# EAGLE design headstage_isolation_board_01 (EAGLE 7.5.0)
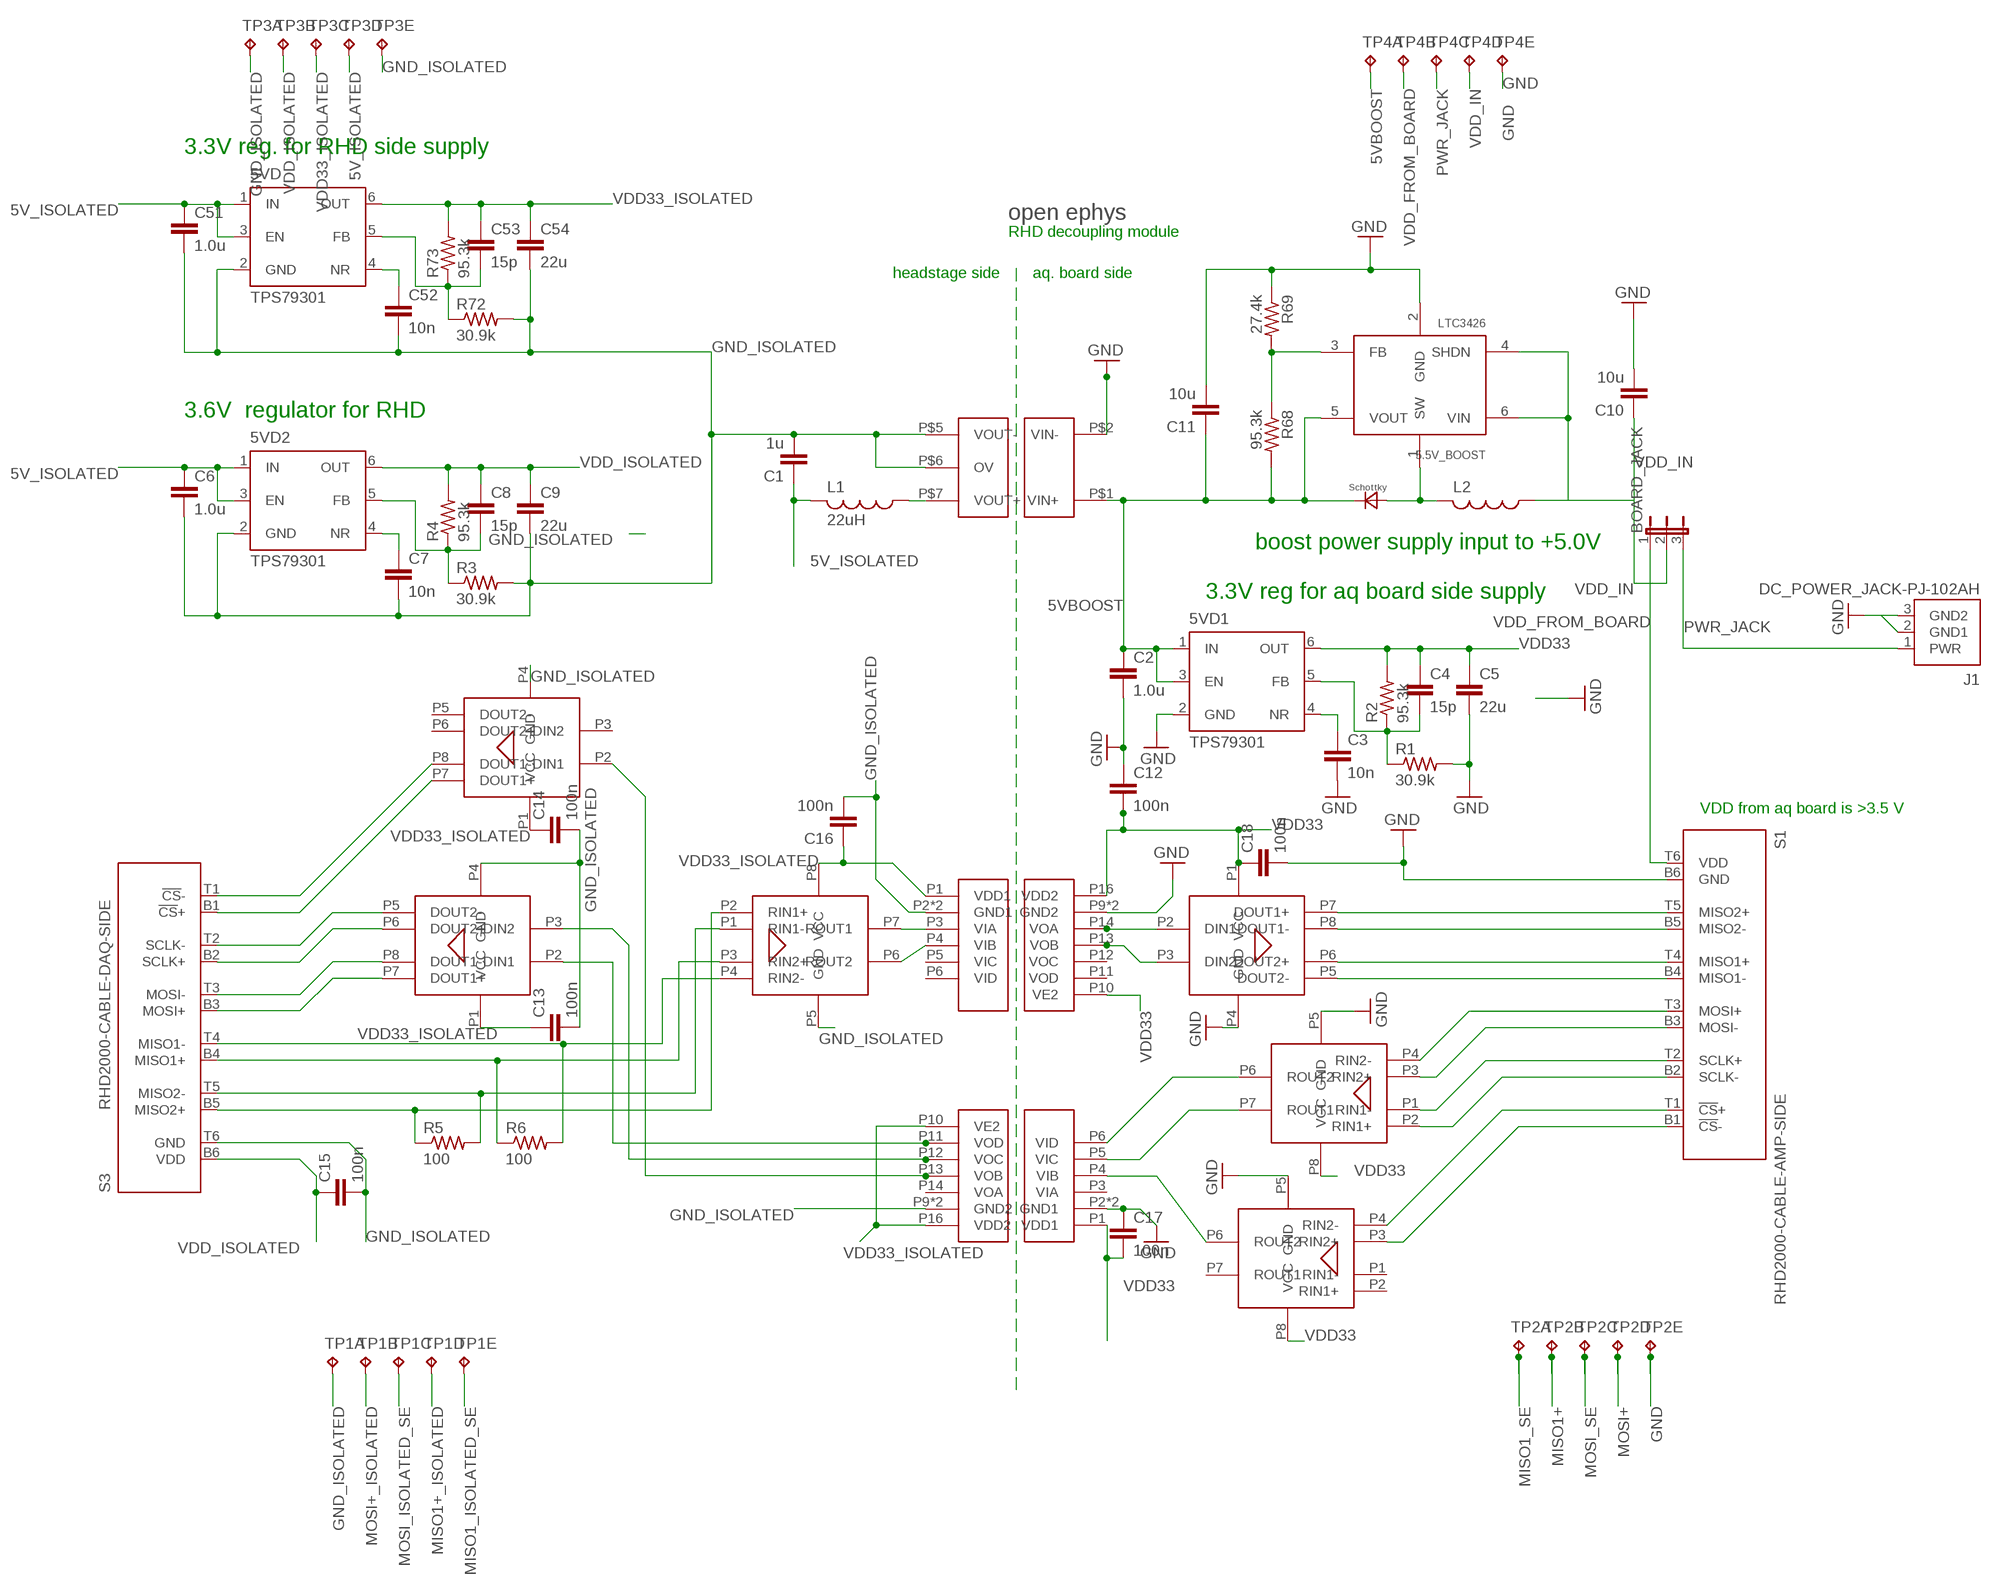
[diagram p0: schematic, sheet 1]

## Parts
5.5V_BOOST  LTC3426  [SOT23-6]
5VD  TPS79301  [SOT-23-6]
5VD1  TPS79301  [SOT-23-6]
5VD2  TPS79301  [SOT-23-6]
BOARD_JACK  JP2E  [JP2]
C1  1u  C_1206  [1206]
C2  1.0u  C_0805  [0805]
C3  10n  C_0603  [0603]
C4  15p  C_0603  [0603]
C5  22u  C_1206  [1206]
C6  1.0u  C_0805  [0805]
C7  10n  C_0603  [0603]
C8  15p  C_0603  [0603]
C9  22u  C_1206  [1206]
C10  10u  C_1206  [1206]
C11  10u  C_1206  [1206]
C12  100n  C_0603  [0603]
C13  100n  C_0603  [0603]
C14  100n  C_0603  [0603]
C15  100n  C_0603  [0603]
C16  100n  C_0603  [0603]
C17  100n  C_0603  [0603]
C18  100n  C_0603  [0603]
C51  1.0u  C_0805  [0805]
C52  10n  C_0603  [0603]
C53  15p  C_0603  [0603]
C54  22u  C_1206  [1206]
D1  MBRA210LT3-D  [MBRA210LT3-D]
J1  DC_POWER_JACK-PJ-102AH  [PJ-102AH]
L1  22uH  L_1206  [1206]
L2  L_1206  [1206]
R1  30.9k  R_0603  [0603]
R2  95.3k  R_0603  [0603]
R3  30.9k  R_0603  [0603]
R4  95.3k  R_0603  [0603]
R5  100  R_0603  [0603]
R6  100  R_0603  [0603]
R68  95.3k  R_0603  [0603]
R69  27.4k  R_0603  [0603]
R72  30.9k  R_0603  [0603]
R73  95.3k  R_0603  [0603]
S1  RHD2000-CABLE-AMP-SIDE  [OMNETICS_PZN-12-AA]
S3  RHD2000-CABLE-DAQ-SIDE  [OMNETICS_PZN-12-AA]
TP1  TP5P5-25-13  [P5-25-13]
TP2  TP5P5-25-13  [P5-25-13]
TP3  TP5P5-25-13  [P5-25-13]
TP4  TP5P5-25-13  [P5-25-13]
U$1  OPEN_EPHYS_LOGO  [OPEN_EPHYS_LOGO]
U$2  ADUM3440  [SOIC_WIDE_16]
U$4  ADN4663  [8-SOIC]
U$5  ADN4663  [8-SOIC]
U$6  ADN4664  [8-SOIC]
U$7  ADN4664  [8-SOIC]
U$8  ADN4664  [8-SOIC]
U$9  ADN4663  [8-SOIC]
U$10  ADUM3440  [SOIC_WIDE_16]
U$12  NMV0505  [NMV0505]

## Nets
5V_ISOLATED: 5VD2.1(IN) 5VD2.3(EN) 5VD.1(IN) 5VD.3(EN) C1.1 C6.1 C51.1 L1.2 TP3.TP-4
5VBOOST: 5.5V_BOOST.5(VOUT) 5VD1.1(IN) 5VD1.3(EN) C2.1 C11.1 D1.NEG R68.2 TP4.TP-1 U$12.P$1(VIN+)
CS+: S1.T1(!CS!+) U$8.P4(RIN2-)
CS+_ISOLATED: S3.B1(!CS!+) U$9.P7(DOUT1+)
CS-: S1.B1(!CS!-) U$8.P3(RIN2+)
CS-_ISOLATED: S3.T1(!CS!-) U$9.P8(DOUT1-)
CS_ISOLATED_SE: U$2.P13(VOB) U$9.P2(DIN1)
CS_SE: U$2.P4(VIB) U$8.P6(ROUT2)
GND: 5.5V_BOOST.2(GND) 5VD1.2(GND) C2.2 C3.2 C5.2 C10.2 C11.2 C12.1 C17.1 C18.2 J1.2(GND1) J1.3(GND2) R1.2 R69.1 S1.B6(GND) TP2.TP-5 TP4.TP-5 U$2.P2(GND1) U$2.P8(GND1) U$4.P4(GND) U$7.P5(GND) U$8.P5(GND) U$10.P9(GND2) U$10.P15(GND2) U$12.P$2(VIN-)
GND4: C15.2
GND_ISOLATED: 5VD2.2(GND) 5VD.2(GND) C1.2 C6.2 C7.2 C9.2 C13.2 C14.2 C16.2 C51.2 C52.2 C54.2 R3.2 R72.2 S3.T6(GND) TP1.TP-1 TP3.TP-1 TP3.TP-5 U$2.P9(GND2) U$2.P15(GND2) U$5.P4(GND) U$6.P5(GND) U$9.P4(GND) U$10.P2(GND1) U$10.P8(GND1) U$12.P$5(VOUT-) U$12.P$6(OV)
MISO1+: S1.T4(MISO1+) TP2.TP-2 U$4.P6(DOUT2+)
MISO1+_ISOLATED: R6.1 S3.B4(MISO1+) TP1.TP-4 U$6.P3(RIN2+)
MISO1-: S1.B4(MISO1-) U$4.P5(DOUT2-)
MISO1-_ISOLATED: R6.2 S3.T4(MISO1-) U$6.P4(RIN2-)
MISO1_ISOLATED_SE: TP1.TP-5 U$6.P6(ROUT2) U$10.P4(VIB)
MISO1_SE: TP2.TP-1 U$4.P3(DIN2) U$10.P13(VOB)
MISO2+: S1.T5(MISO2+) U$4.P7(DOUT1+)
MISO2+_ISOLATED: R5.1 S3.B5(MISO2+) U$6.P2(RIN1+)
MISO2-: S1.B5(MISO2-) U$4.P8(DOUT1-)
MISO2-_ISOLATED: R5.2 S3.T5(MISO2-) U$6.P1(RIN1-)
MISO2_ISOLATED_SE: U$6.P7(ROUT1) U$10.P3(VIA)
MISO2_SE: U$4.P2(DIN1) U$10.P14(VOA)
MOSI+: S1.T3(MOSI+) TP2.TP-4 U$7.P4(RIN2-)
MOSI+_ISOLATED: S3.B3(MOSI+) TP1.TP-2 U$5.P7(DOUT1+)
MOSI-: S1.B3(MOSI-) U$7.P3(RIN2+)
MOSI-_ISOLATED: S3.T3(MOSI-) U$5.P8(DOUT1-)
MOSI_ISOLATED_SE: TP1.TP-3 U$2.P11(VOD) U$5.P2(DIN1)
MOSI_SE: TP2.TP-3 U$2.P6(VID) U$7.P6(ROUT2)
N$32: L1.1 U$12.P$7(VOUT+)
N$33: 5VD1.4(NR) C3.1
N$35: 5VD1.5(FB) C4.2 R1.1 R2.1
N$36: 5VD2.4(NR) C7.1
N$37: 5VD2.5(FB) C8.2 R3.1 R4.1
N$97: 5VD.4(NR) C52.1
N$108: 5VD.5(FB) C53.2 R72.1 R73.1
N$276: 5.5V_BOOST.3(FB) R68.1 R69.2
N$278: 5.5V_BOOST.1(SW) D1.POS L2.2
PWR_JACK: BOARD_JACK.3 J1.1(PWR) TP4.TP-3
SCLK+: S1.T2(SCLK+) U$7.P1(RIN1-)
SCLK+_ISOLATED: S3.B2(SCLK+) U$5.P6(DOUT2+)
SCLK-: S1.B2(SCLK-) U$7.P2(RIN1+)
SCLK-_ISOLATED: S3.T2(SCLK-) U$5.P5(DOUT2-)
SCLK_ISOLATED_SE: U$2.P12(VOC) U$5.P3(DIN2)
SCLK_SE: U$2.P5(VIC) U$7.P7(ROUT1)
VDD33: 5VD1.6(OUT) C4.1 C5.1 C12.2 C17.2 C18.1 R2.2 U$2.P1(VDD1) U$4.P1(VCC) U$7.P8(VCC) U$8.P8(VCC) U$10.P10(VE2) U$10.P16(VDD2)
VDD33_ISOLATED: 5VD.6(OUT) C13.1 C14.1 C16.1 C53.1 C54.1 R73.2 TP3.TP-3 U$2.P10(VE2) U$2.P16(VDD2) U$5.P1(VCC) U$6.P8(VCC) U$9.P1(VCC) U$10.P1(VDD1)
VDD_FROM_BOARD: BOARD_JACK.1 S1.T6(VDD) TP4.TP-2
VDD_IN: 5.5V_BOOST.4(SHDN) 5.5V_BOOST.6(VIN) BOARD_JACK.2 C10.1 L2.1 TP4.TP-4
VDD_ISOLATED: 5VD2.6(OUT) C8.1 C9.1 C15.1 R4.2 S3.B6(VDD) TP3.TP-2
Unconnected: U$2.P3(VIA) U$2.P14(VOA) U$8.P1(RIN1-) U$8.P2(RIN1+) U$8.P7(ROUT1) U$9.P3(DIN2) U$9.P5(DOUT2-) U$9.P6(DOUT2+) U$10.P5(VIC) U$10.P6(VID) U$10.P11(VOD) U$10.P12(VOC)

## Notes on the sheet
- 3.3V reg. for RHD side supply
- RHD decoupling module
- headstage side | aq. board side
- 3.6V  regulator for RHD
- boost power supply input to +5.0V
- 3.3V reg for aq board side supply
- VDD from aq board is >3.5 V

## Library data of the parts
5.5V_BOOST = open-ephys:LTC3426: Boost converter
5VD 5VD1 5VD2 = RHD2000_eval_board:TPS79301: Texas Instruments TPS79301 adjustable regulator
BOARD_JACK = jumper:JP2E: JUMPER
C1-C18 C51-C54 = RHD2000_eval_board:C: Capacitor
D1 = open-ephys:MBRA210LT3-D: Schottky diode
J1 = RHD2000_eval_board:DC_POWER_JACK: DC Power Jack
L1 L2 = RHD2000_eval_board:L: Inductor
R1-R6 R68 R69 R72 R73 = RHD2000_eval_board:R: Resistor
S1 = RHD2000:RHD2000-CABLE-AMP-SIDE
S3 = RHD2000_eval_board:RHD2000-CABLE-DAQ-SIDE: Omnetics PZN-12-AA RHD2000 socket - DAQ side
TP1-TP4 = testpad:TP5: Test pad
U$1 = open-ephys:OPEN_EPHYS_LOGO: Open Ephys logo
U$2 U$10 = open-ephys_old:ADUM3440
U$4 U$5 U$9 = open-ephys:ADN4663
U$6-U$8 = open-ephys:ADN4664
U$12 = open-ephys:NMV0505

## Net classes
1 power: width 0.381 mm

## Board
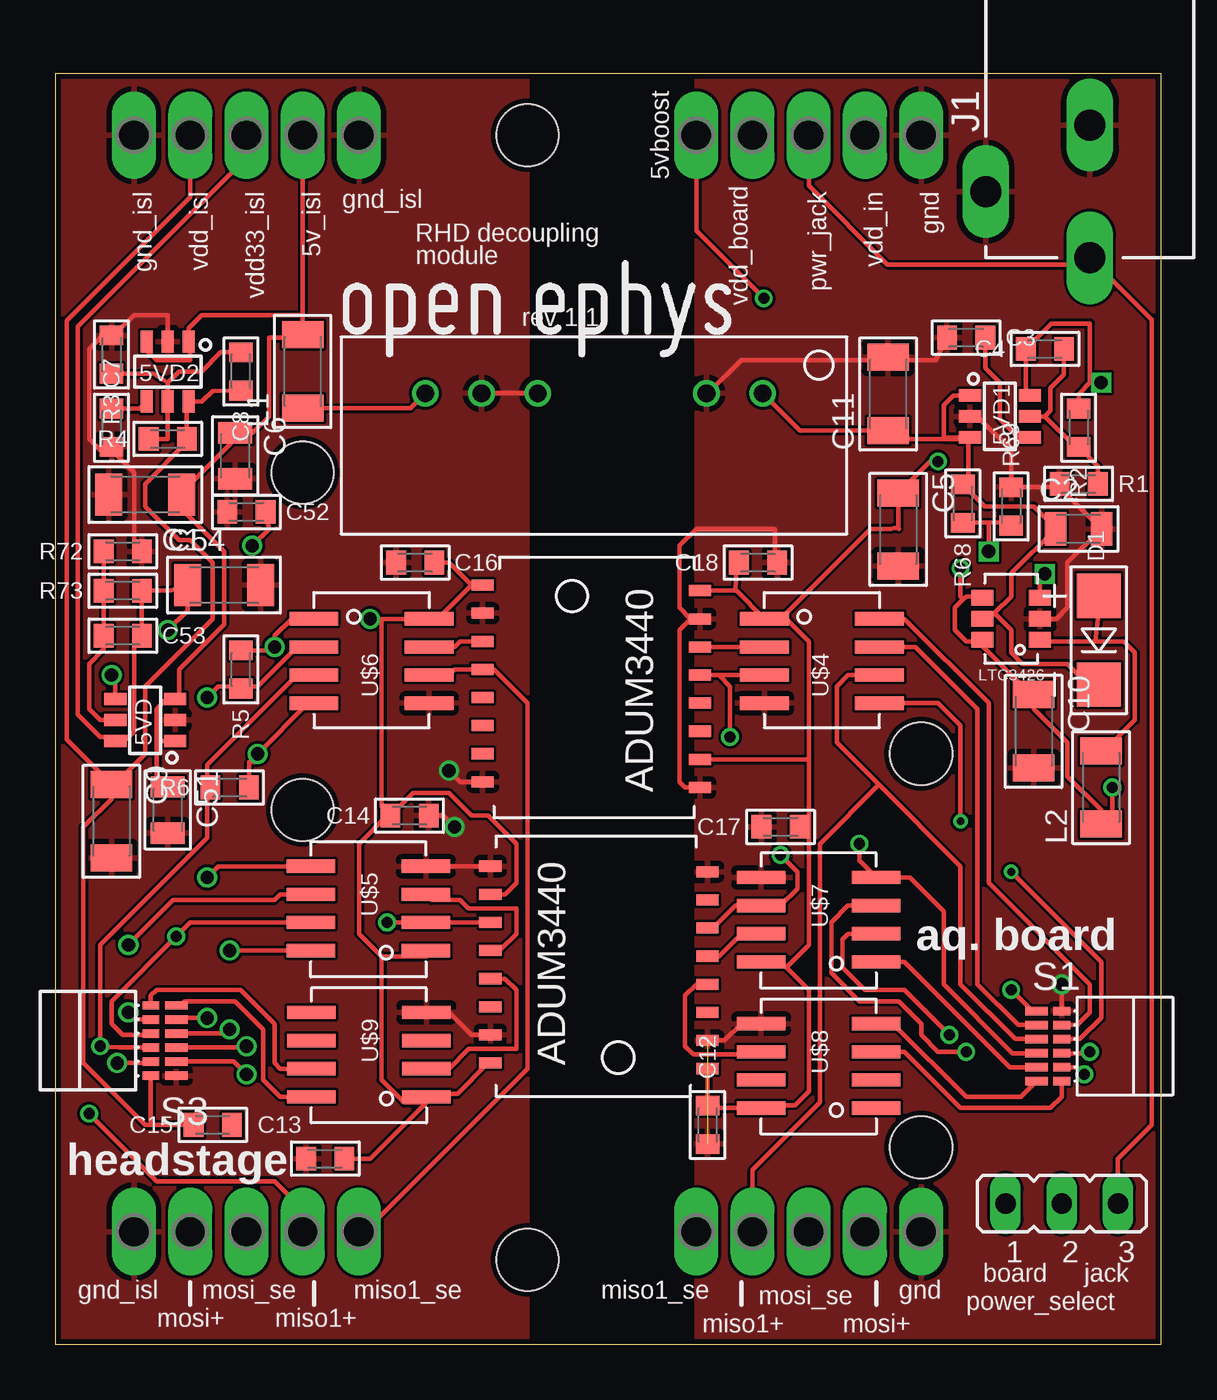
[diagram p1: board, top side]
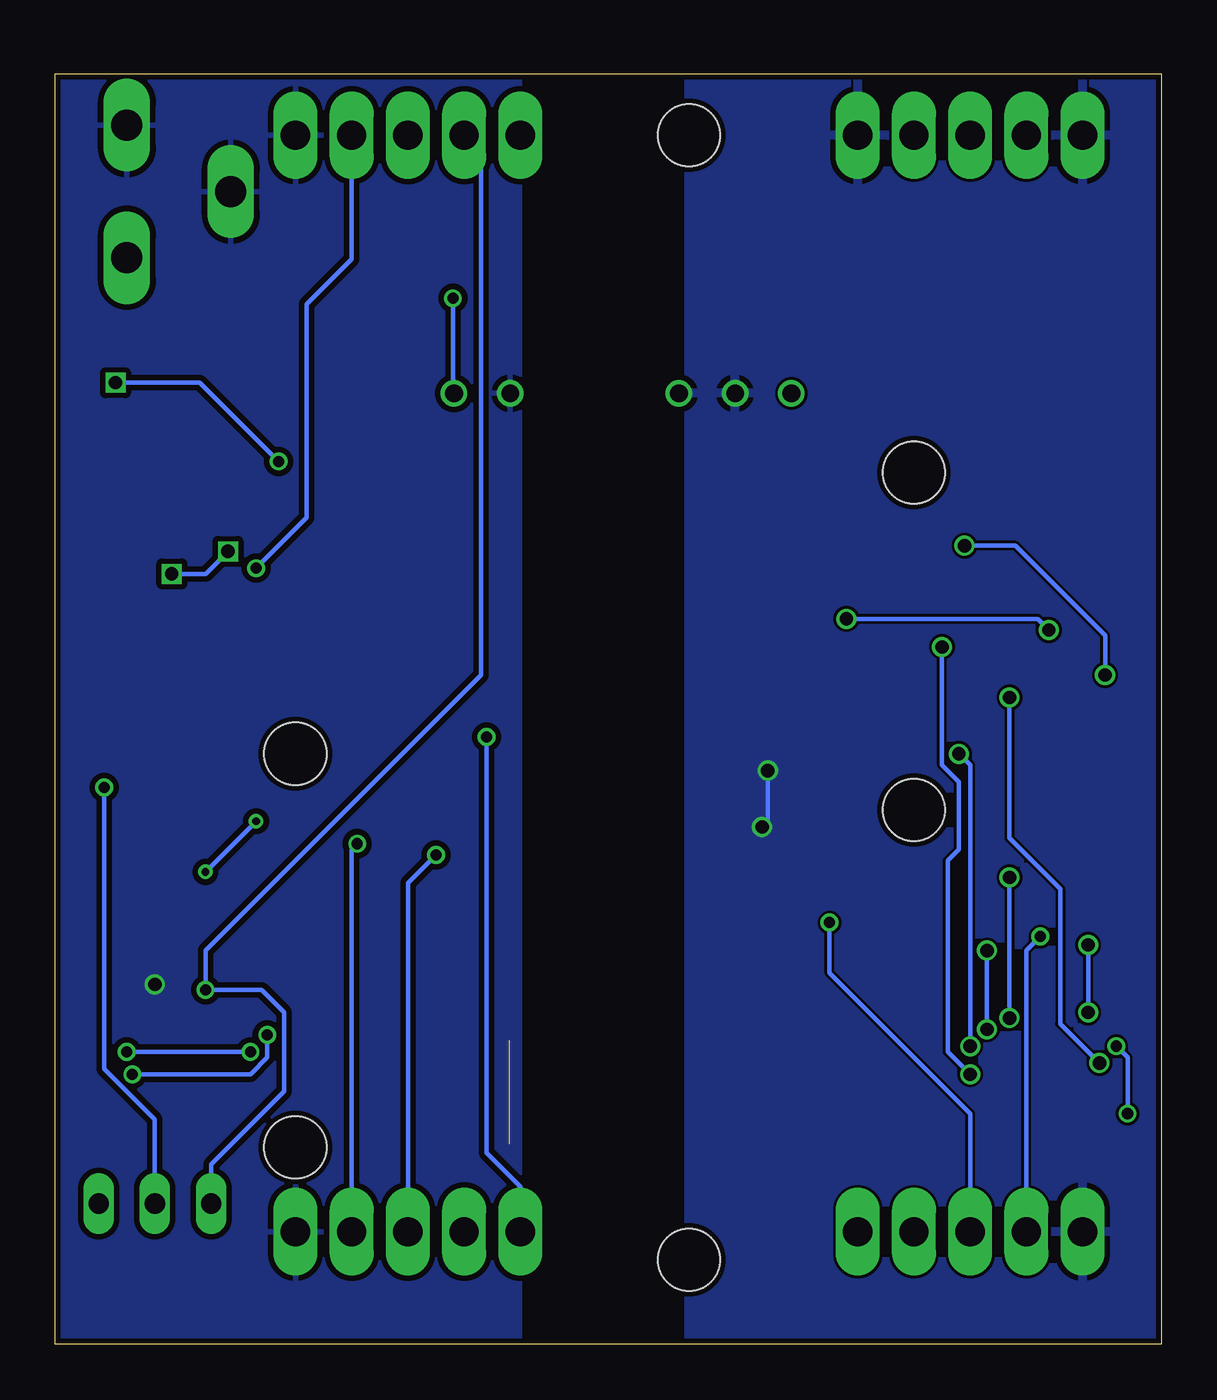
[diagram p2: board, bottom side, seen from below]

Size 49.96 x 57.39 mm. Coordinates in mm from the lower left corner, seen from the top.
Outline: 0,0 49.96,0 49.96,57.39 0,57.39 0,0
Copper layers (1*16): Top 0.0178mm / dielectric 59mil / Bottom 0.0178mm
Design rules "default": minimum track width 5mil, minimum drill 10mil, track to track 5mil, track to pad 5mil, pad to pad 5mil, via to via 5mil, smd to smd 5mil, copper to edge 10mil, drill to drill 16mil, minimum pad ring 6mil, minimum via ring 6mil, stop-mask expansion 3mil, vias tented up to drill 0mil, thermal gap 10mil
Holes 2.8 mm at 21.34,3.81 21.34,54.61 11.18,39.37 11.18,24.13 39.12,26.67 39.12,8.89

### Footprints (pad centres in the part's own frame; a part is rotated, then mirrored left to right if it is on the bottom)
SOT23-6 = smd 1 x 0.7: 1 -1.3,0.95; 2 -1.3,0; 3 -1.3,-0.95; 4 1.3,-0.95; 5 1.3,0; 6 1.3,0.95
SOT-23-6 = smd 1 x 0.55: 1 -1.35,0.95; 2 -1.35,0; 3 -1.35,-0.95; 4 1.35,-0.95; 5 1.35,0; 6 1.35,0.95
JP2 = drill 0.914 long: 1 -2.54,0; 2 0,0; 3 2.54,0
1206 = smd 1.219 x 1.88: 1 -1.651,0; 2 1.651,0
0805 = smd 0.965 x 1.524: 1 -1.041,0; 2 1.041,0
0603 = smd 0.889 x 1.067: 1 -0.864,0; 2 0.864,0
MBRA210LT3-D = smd 2 x 2: NEG -2,0; POS 2,0
PJ-102AH = drill 1.4 long: 1 0,-3; 2 0,3; 3 -4.7,0
OMNETICS_PZN-12-AA = smd 0.381 x 0.762: B1 1.587,-1.016; B2 0.953,-1.016; B3 0.318,-1.016; B4 -0.318,-1.016; B5 -0.953,-1.016; B6 -1.587,-1.016 | smd 0.381 x 1.016: T1 1.587,-2.159; T2 0.953,-2.159; T3 0.318,-2.159; T4 -0.318,-2.159; T5 -0.953,-2.159; T6 -1.587,-2.159
P5-25-13 = drill 1.321 pad 1.905 long: TP-1 -5.08,0; TP-2 -2.54,0; TP-3 0,0; TP-4 2.54,0; TP-5 5.08,0
SOIC_WIDE_16 = smd 0.5 x 1: P1 -4.064,-4.064; P2 -2.794,-4.064; P3 -1.524,-4.064; P4 -0.254,-4.064; P5 1.016,-4.064; P6 2.286,-4.064; P7 3.556,-4.064; P8 4.826,-4.064; P9 5.08,5.75; P10 3.81,5.75; P11 2.54,5.75; P12 1.27,5.75; P13 0,5.75; P14 -1.27,5.75; P15 -2.54,5.75; P16 -3.81,5.75
8-SOIC = smd 2.2 x 0.6: P1 0,3.81; P2 0,2.54; P3 0,1.27; P4 0,0; P5 5.2,0; P6 5.2,1.27; P7 5.2,2.54; P8 5.2,3.81
NMV0505 = drill 0.8: P$1 2.54,2.54; P$2 5.08,2.54; P$5 12.7,2.54; P$6 15.24,2.54; P$7 17.78,2.54

### Placement (x,y rotation side)
5.5V_BOOST  43.18,32.77 180 top
5VD  4.06,28.19 180 top
5VD1  42.67,41.91 0 top
5VD2  5.08,43.94 270 top
BOARD_JACK  45.47,6.35 0 top
C1  4.06,38.38 180 top
C2  46.23,36.83 0 top
C3  41.15,45.47 180 top
C4  44.7,44.96 0 top
C5  38.07,36.8 270 top
C6  8.13,40.13 270 top
C7  2.54,41.4 270 top
C8  8.38,43.94 90 top
C9  2.54,23.62 270 top
C10  44.2,27.69 270 top
C11  37.62,42.93 90 top
C12  29.46,9.91 90 top
C13  12.19,8.38 180 top
C14  16,23.88 0 top
C15  7.11,9.91 0 top
C16  16.26,35.31 180 top
C17  32.77,23.37 0 top
C18  31.75,35.31 0 top
C51  5.08,24.13 270 top
C52  8.64,37.59 180 top
C53  3.05,32 180 top
C54  7.62,34.29 0 top
D1  47.14,31.8 90 top
J1  46.74,52.07 0 top
L1  11.18,43.94 90 top
L2  47.24,25.15 90 top
R1  46.23,38.86 180 top
R2  46.23,41.4 90 top
R3  2.54,44.7 90 top
R4  5.08,40.89 0 top
R5  8.38,30.48 90 top
R6  7.87,25.15 0 top
R68  41,37.97 90 top
R69  43.18,37.85 270 top
R72  3.05,35.81 0 top
R73  3.05,34.04 0 top
S1  46.48,13.46 270 top
S3  3.3,13.72 90 top
TP1  8.64,5.08 0 top
TP2  34.04,5.08 0 top
TP3  8.64,54.61 0 top
TP4  34.04,54.61 0 top
U$1  12.34,44.12 0 top
U$2  25.4,16.51 90 top
U$4  32.03,28.96 0 top
U$5  16.74,21.59 180 top
U$6  11.68,28.96 0 top
U$7  37.08,21.08 180 top
U$8  37.08,14.48 180 top
U$9  16.76,14.99 180 top
U$10  23.37,30.23 270 top
U$12  34.49,45.49 180 top

### Tracks (layer width: path | path; a pad name or v marks a point on that pad's centre or on a via)
5V_ISOLATED
  Top 0.203: 5VD2.3 4.13,44.89 4.57,44.45 6.1,44.45 6.1,45.47 6.03,45.4 5VD2.1 6.03,45.91 6.6,46.48 11.18,46.48 | 11.18,46.48 L1.2 11.05,45.47 9.65,45.47 9.65,41.91 8.92,41.17 C6.1 7.9,40.66 6.1,38.86 6.1,38.76 C1.1 5.71,37.72 7.62,35.81 7.62,32.51 5.59,30.48 5.59,29.21 5.48,29.21 5VD.3 5.01,29.14 4.57,28.7 4.57,27.18 | 4.57,27.18 4.57,25.68 C51.1 | 5VD.1 4.64,27.24 4.57,27.18 | TP3.TP-4 11.18,46.48
5VBOOST  (via drill 0.5)
  Top 0.203: 5VD1.1 40.57,42.86 40.13,42.42 40.13,40.89 | 40.13,40.89 41.26,40.89 | 41.26,40.89 5VD1.3 40.2,40.96 40.13,40.89 | 40.13,40.89 38,40.89 C11.1 33.63,41.27 U$12.P$1 | 41.26,40.89 41.26,39.1 R68.2 41.99,37.85 44.2,37.85 45.19,36.85 C2.1 43.18,34.82 43.18,33.78 42.42,33.02 | 5.5V_BOOST.5 42.16,32.77 42.42,33.02 | D1.NEG 46.65,29.8 45.72,30.73 43.69,30.73 43.18,31.24 43.18,32.26 42.42,33.02 | TP4.TP-1 28.96,50.29 v32,47.24
  Bottom 0.203: v32,47.24 32,43 U$12.P$1
CS+
  Top 0.203: U$8.P4 37.85,14.48 41.15,11.18 43.62,11.18 S1.T1
CS+_ISOLATED
  Top 0.203: S3.B1 4.32,15.75 4.57,16 8.38,16 9.91,14.48 9.91,12.7 10.16,12.45 U$9.P7
CS-
  Top 0.203: U$8.P3 38.35,13.21 40.89,10.67 44.96,10.67 45.47,11.18 S1.B1
CS-_ISOLATED
  Top 0.203: U$9.P8 10.16,11.18 9.4,11.94 9.4,14.22 8.13,15.49 5.84,15.49 5.59,15.24 5.52,15.24 S3.T1
CS_ISOLATED_SE
  Top 0.203: U$2.P13 20.32,16.51 20.83,16 20.83,13.33 18.67,13.33 17.78,12.45 U$9.P2
CS_SE
  Top 0.203: U$8.P6 31.88,13.08 28.83,13.08 28.45,13.46 28.45,15.75 28.96,16.26 U$2.P4
GND  (via drill 0.6)  (1 unrouted)
  Top 0.203: U$2.P2 30.23,13.72 30.99,14.48 U$8.P5 | U$12.P$2 29.49,42.95 30.99,44.45 39.78,44.45 C3.2 | R69.1 43.18,40.39 41.66,41.91 5VD1.2 | R69.1 43.84,38.71 | R69.1 45.06,38.71 45.21,38.86 47.24,36.83 | C2.2 47.24,36.83 | 5.5V_BOOST.2 45.21,32.77 45.72,33.27 45.72,35.31 47.24,36.83 | S1.B6 v45.47,16.26 | U$10.P9 28.45,25.15 28.19,25.4 28.19,32.26 28.7,32.77 | U$10.P15 28.7,32.77 | 28.7,32.77 28.19,33.27 28.19,36.07 28.96,36.83 32.51,36.83 32.51,35.41 C18.2
  pour Bottom (isolate 0.254): 56.9,-4.57 28.96,-3.88 28.96,62.23 61.09,58.42
  pour Top: 55.37,-4.57 28.96,-2.54 28.96,59.69 56.13,60.45
GND_ISOLATED  (via drill 0.6)
  Top 0.203: U$2.P9 U$5.P4 | U$2.P15 18.8,13.97 17.78,14.99 U$9.P4 | U$12.P$5 19.33,42.95 19.3,42.93 | 5VD2.2 5.08,46.48 3.56,46.48 2.9,45.82 R3.2 2.39,45.82 1.52,44.96 1.52,40.89 2.03,40.39 2.39,40.39 | 2.39,40.39 C7.2 | 2.39,40.39 2.54,40.39 3.56,39.37 3.56,36.32 4.06,35.81 | U$10.P8 18.29,25.4 v17.78,25.91 | v18.03,23.37 17.53,23.88 C14.2
  Bottom 0.203: v17.78,25.91 17.78,23.62 v18.03,23.37
  pour Bottom: 21.34,61.98 -3.56,58.42 -3.81,-0.76 21.34,-6.1
  pour Top: 21.34,61.98 -2.54,59.44 -3.05,-2.79 21.34,-6.1
MISO1+
  Top 0.203: S1.T4 43.37,13.78 40.89,16.26 40.89,21.59 37.21,25.27 | 37.21,25.27 35.31,27.18 35.31,29.72 35.81,30.23 U$4.P6 | TP2.TP-2 31.5,7.87 34.54,10.92 34.54,22.61 37.21,25.27
MISO1+_ISOLATED  (via drill 0.5)
  Top 0.203: S3.B4 2.86,13.4 v2.03,13.46 2.03,18.03 6.86,22.86 6.86,25.15 | 6.86,25.15 6.86,26.16 10.92,30.23 U$6.P3 | TP1.TP-4 11.18,6.1 9.91,7.37 4.57,7.37 v1.52,10.41 | R6.1 6.86,25.15
  Bottom 0.203: v1.52,10.41 1.52,12.95 v2.03,13.46
MISO1-  (via drill 0.36)
  Top 0.203: S1.B4 46.29,13.78 47.24,14.73 47.24,17.27 v43.18,21.34 | v40.89,23.62 40.89,27.94 39.88,28.96 38.35,28.96 37.08,29.1 U$4.P5
  Bottom 0.203: v43.18,21.34 v40.89,23.62
MISO1-_ISOLATED  (via drill 0.6)
  Top 0.203: S3.T4 8.57,13.4 v8.64,13.46 | U$6.P4 11.43,28.96 v9.14,26.67 9.14,26.29 8.76,26.29 8.76,25.15 R6.2
  Bottom 0.203: v8.64,13.46 8.64,26.16 v9.14,26.67
MISO1_ISOLATED_SE
  Top 0.203: U$6.P6 17.78,30.23 18.03,30.48 U$10.P4 19.81,30.48 21.34,28.96 21.34,12.45 13.97,5.08 TP1.TP-5
MISO1_SE  (via drill 0.5)
  Top 0.203: U$10.P13 29.97,30.23 | 29.97,30.23 U$4.P3 | v30.48,27.43 30.48,29.72 29.97,30.23
  Bottom 0.203: TP2.TP-1 28.96,7.11 30.48,8.64 v30.48,27.43
MISO2+
  Top 0.203: S1.T5 43.5,14.41 41.66,16.26 41.66,28.7 38.86,31.5 U$4.P7
MISO2+_ISOLATED  (via drill 0.6)
  Top 0.203: U$6.P2 10.92,31.5 9.14,29.72 8.38,29.72 | 8.38,29.72 7.37,29.72 v6.86,29.21 | v2.79,12.7 3.87,12.7 S3.B5 | R5.1 8.38,29.72
  Bottom 0.203: v6.86,29.21 6.86,22.86 4.57,20.57 4.57,14.48 v2.79,12.7
MISO2-
  Top 0.203: S1.B5 46.16,14.41 46.74,14.99 46.74,16.26 42.16,20.83 42.16,28.96 38.35,32.77 U$4.P8
MISO2-_ISOLATED  (via drill 0.6)
  Top 0.203: S3.T5 8.07,12.76 v8.64,12.19 | U$6.P1 10.67,32.77 9.91,32 v9.91,31.5 9.91,31.34 R5.2
  Bottom 0.203: v8.64,12.19 9.65,13.21 9.65,21.84 9.14,22.35 9.14,25.4 9.91,26.16 v9.91,31.5
MISO2_ISOLATED_SE
  Top 0.203: U$10.P3 18.29,31.75 18.03,31.5 U$6.P7
MISO2_SE
  Top 0.203: U$4.P2 U$10.P14
MOSI+  (via drill 0.5)
  Top 0.203: S1.T3 43.24,13.14 40.13,16.26 40.13,19.56 38.61,21.08 U$7.P4 36.32,21.84 v36.32,22.61
  Bottom 0.203: TP2.TP-4 36.58,22.35 v36.32,22.61
MOSI+_ISOLATED  (via drill 0.5)
  Top 0.203: U$5.P7 6.1,19.05 v5.46,18.42 2.54,15.49 2.54,14.48 3.05,13.97 4.25,13.97 S3.B3
  Bottom 0.203: TP1.TP-2 6.1,17.78 v5.46,18.42
MOSI-  (via drill 0.5)
  Top 0.203: S1.B3 46.67,13.14 v46.74,13.21 | v41.15,13.21 39.88,13.21 39.12,13.97 39.12,14.48 38.1,15.49 36.32,15.49 35.05,16.76 35.05,19.05 35.81,19.81 U$7.P3
  Bottom 0.203: v46.74,13.21 v41.15,13.21
MOSI-_ISOLATED  (via drill 0.6)
  Top 0.203: S3.T3 7.68,14.03 v7.87,14.22 | v7.87,17.78 U$5.P8
  Bottom 0.203: v7.87,14.22 v7.87,17.78
MOSI_ISOLATED_SE  (via drill 0.5)
  Top 0.203: U$2.P11 U$5.P2 v14.99,19.05
  Bottom 0.203: TP1.TP-3 8.64,10.41 14.99,16.76 v14.99,19.05
MOSI_SE  (via drill 0.5)
  Top 0.203: U$2.P6 29.72,18.8 30.73,19.81 U$7.P6 32.77,19.81 33.53,20.57 33.53,21.34 v32.77,22.1
  Bottom 0.203: TP2.TP-3 34.04,20.83 v32.77,22.1
N$32
  Top 0.203: L1.1 16.05,42.29 U$12.P$7
N$33
  Top 0.203: C3.1 42.01,44.09 42.67,43.43 42.67,41.78 43.43,41.02 43.96,40.89 5VD1.4
N$35
  Top 0.203: C4.2 45.57,43.79 44.96,43.18 44.96,42.16 44.7,41.91 | 44.7,41.91 5VD1.5 | 44.7,41.91 46.08,40.54 R2.1 47.09,39.67 R1.1
N$36
  Top 0.203: C7.1 3.8,42.27 5VD2.4
N$37
  Top 0.203: R3.1 4.42,43.84 5.08,43.43 | 5.08,43.43 5VD2.5 5.08,40.89 R4.1 | C8.2 7.47,44.81 6.6,43.94 5.59,43.94 5.08,43.43
N$97  (via drill 0.6)
  Top 0.203: C52.1 9.65,36.83 v8.89,36.07 | 5VD.4 2.71,30.05 v2.54,30.23
  Bottom 0.203: v2.54,30.23 2.54,32 6.6,36.07 v8.89,36.07
N$108
  Top 0.203: R72.1 2.18,34.44 2.03,34.29 2.03,34.19 R73.1 C53.2 | C53.2 2.18,31.9 2.03,31.75 | C53.2 2.18,31.39 1.52,30.73 1.52,28.7 2.03,28.19 5VD.5
N$276  (via drill 0.6)
  Top 0.203: R68.1 42.16,37.11 | 42.16,37.11 43.05,37.11 R69.2 | 5.5V_BOOST.3 44.48,34.57 v44.7,34.8 | v42.16,35.81 42.16,37.11
  Bottom 0.203: v44.7,34.8 43.18,34.8 v42.16,35.81
N$278
  Top 0.203: D1.POS 47.14,33.17 46.99,31.75 | 46.99,31.75 44.55,31.75 5.5V_BOOST.1 | 46.99,31.75 48.26,31.75 48.77,31.24 48.77,28.19 47.24,26.67 L2.2
PWR_JACK
  Top 0.203: BOARD_JACK.3 48.01,8.38 49.53,9.91 49.53,46.28 J1.1 46.43,48.77 37.59,48.77 34.04,52.32 TP4.TP-3
SCLK+
  Top 0.203: S1.T2 43.12,12.51 38.35,17.27 U$7.P1
SCLK+_ISOLATED  (via drill 0.6)
  Top 0.203: S3.B2 3.62,14.67 v3.3,14.99 | v3.3,18.03 5.33,20.07 9.91,20.07 10.16,20.32 U$5.P6
  Bottom 0.203: v3.3,14.99 v3.3,18.03
SCLK-  (via drill 0.5)
  Top 0.203: 45.53,12.45 S1.B2 46.16,12.51 v46.48,12.19 | v40.39,13.97 38.35,16 36.58,16 35.56,17.02 35.56,18.29 35.81,18.54 U$7.P2
  Bottom 0.203: v46.48,12.19 41.15,12.19 40.39,12.95 v40.39,13.97
SCLK-_ISOLATED  (via drill 0.6)
  Top 0.203: U$5.P5 7.37,21.59 v6.86,21.08 | v6.86,14.73 5.52,14.73 S3.T2
  Bottom 0.203: v6.86,21.08 v6.86,14.73
SCLK_ISOLATED_SE
  Top 0.203: U$2.P12 20.07,17.78 20.83,18.54 20.83,19.69 18.67,19.69 18.29,20.07 16.99,20.07 U$5.P3
SCLK_SE
  Top 0.203: U$2.P5 29.97,17.53 30.99,18.54 U$7.P7
VDD33  (via drill 0.5, 0.6)
  Top 0.203: U$10.P16 30.73,34.04 | 30.73,34.04 30.76,34.04 U$4.P1 33.02,32.77 | U$2.P1 C12.2 29.46,10.67 U$8.P8 32.01,10.79 33.4,10.79 34.04,11.43 34.04,16 33.02,17.02 | 5VD1.6 43.84,43.04 C4.1 44.98,46.1 46.74,46.1 46.74,43.43 | R2.2 46.23,42.93 46.74,43.43 | 38.08,36.85 C5.1 39.5,39.88 v39.88,39.88 | 38.08,36.85 38.1,36.83 | v47.24,43.43 46.74,43.43 | 38.08,36.85 37.87,36.85 37.72,36.83 36.83,36.83 33.02,33.02 33.02,32.77 | U$7.P8 32.77,17.27 33.02,17.02 | 33.02,32.77 34.04,31.75 34.04,26.42 | 34.04,26.42 34.04,23.37 | 34.04,23.37 34.04,18.03 33.02,17.02 | C17.2 34.04,23.37 | C18.1 30.76,35.08 30.73,34.04 | U$10.P10 34.04,26.42
  Bottom 0.203: v47.24,43.43 43.43,43.43 v39.88,39.88
VDD33_ISOLATED  (via drill 0.6)
  Top 0.203: U$2.P16 19.56,12.7 18.16,11.3 17.02,11.3 U$9.P1 | C14.1 14.99,23.88 13.72,22.61 13.72,18.54 14.73,17.53 | 14.73,17.53 16.76,17.53 16.76,17.76 U$5.P1 | U$10.P1 18.8,34.29 | 18.8,34.29 17.27,32.77 U$6.P8 14.73,32.77 | C16.1 17.78,35.31 18.8,34.29 | 14.73,32.77 14.73,24.28 C14.1 | 14.73,17.53 14.73,11.94 15.75,10.92 16.51,10.92 U$9.P1 | v5.08,32.26 5.97,33.15 C54.1 5.21,34.04 R73.2 C53.1 3.56,31.65 3.56,27.69 3.11,27.24 5VD.6 2.53,27.43 2.03,27.43 1.02,28.45 1.02,45.97 8.64,53.59 TP3.TP-3 | v14.22,32.77 14.73,32.77 | U$9.P1 16.76,10.92 14.22,8.38 C13.1 | U$2.P10 20.32,20.32 20.83,20.83 20.83,22.61 19.56,23.88 18.8,23.88 17.78,24.89 16.15,24.89 C14.1
  Bottom 0.203: v5.08,32.26 5.59,32.77 v14.22,32.77
VDD_FROM_BOARD  (via drill 0.5)
  Top 0.203: S1.T6 44.13,15.05 v43.18,16
  Bottom 0.203: BOARD_JACK.1 42.93,8.13 39.62,11.43 39.62,14.99 40.64,16 v43.18,16 43.18,17.78 30.73,30.23 30.73,53.85 TP4.TP-2
VDD_IN  (via drill 0.5)
  Top 0.203: 5.5V_BOOST.4 41.72,33.72 41.66,33.78 41.15,33.78 41.02,33.66 | 41.02,33.66 40.64,33.27 40.64,32.26 41.15,31.75 41.81,31.75 5.5V_BOOST.6 41.88,31.53 44.2,29.21 | 44.2,29.21 44.2,28.7 45.72,27.18 45.72,25.65 47.24,24.13 L2.1 47.75,24 v47.75,25.15 | 44.2,29.21 C10.1 | v40.89,35.05 40.89,33.78 41.02,33.66
  Bottom 0.203: BOARD_JACK.2 45.47,10.16 47.75,12.45 v47.75,25.15 | TP4.TP-4 36.58,49.02 38.61,46.99 38.61,37.34 v40.89,35.05
VDD_ISOLATED
  Top 0.203: C8.1 7.11,43.05 6.6,42.57 6.05,42.57 5VD2.6 5.94,42.51 R4.2 5.94,40.74 4.06,38.86 4.06,37.85 5.59,36.32 6.1,36.32 7.11,35.31 7.11,32.77 4.06,29.72 4.06,26.67 2.54,25.15 | 2.54,25.15 2.54,24.64 1.27,23.37 1.27,12.7 4.06,9.91 4.32,9.91 | S3.B6 4.32,9.91 | 4.32,9.91 C15.1 | 2.54,25.15 C9.1 0.51,27.3 0.51,46.23 6.1,51.82 TP3.TP-2

### Text on the board
tNames: 5vboost | gnd_isl | vdd_isl | vdd33_isl | 5v_isl | vdd_board | pwr_jack | vdd_in | gnd | gnd_isl | RHD decoupling | module | rev 1.1 | aq. board | headstage | board | jack | gnd_isl | mosi_se | miso1_se | miso1_se | mosi_se | gnd | mosi+ | miso1+ | power_select | miso1+ | mosi+